# Altium project AD8317.PrjPcb
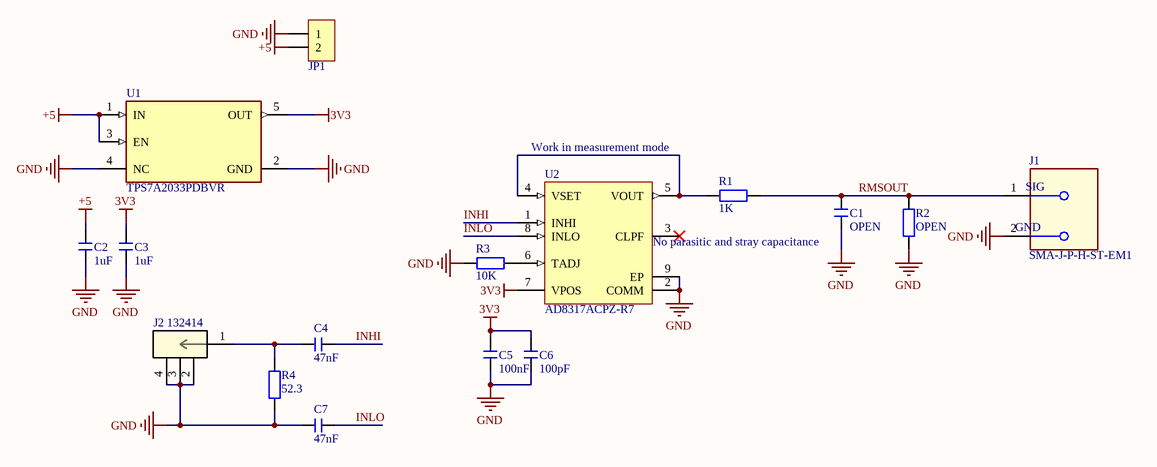
[diagram p0: AD8317.SchDoc]
1 sheet, 16 parts. Net scope: global (net labels, ports and power ports of the same name join across sheets).
Board file: AD8317.PcbDoc

## Sheet AD8317.SchDoc
size A2; SheetNumber: 1; SheetTotal: 1

### Parts
C1  OPEN  [C 0402_L]
C2  1uF  [C 0402_L]
C3  1uF  [C 0402_L]
C4  47nF  [C 0402_L]
C5  100nF  [C 0402_L]
C6  100pF  [C 0402_L]
C7  47nF  [C 0402_L]
J1  SMA-J-P-H-ST-EM1  [FP-SMA-J-P-H-ST-EM1-MFG]
J2  132414  [CONN_132414_AMP]
JP1  HDR-1X2  [KF2510-LI-2P]  (value not drawn)
R1  1K  [R 0402_L]
R2  OPEN  [R 0402_L]
R3  10K  [R 0402_L]
R4  52.3  [R 0402_L]
U1  TPS7A2033PDBVR  [FP-DBV0005A-IPC_C]
U2  AD8317ACPZ-R7  [ADI-CP-8-1_L]

### Nets
3V3: C3.2 C5.2 C6.2 U1.5(OUT) U2.7(VPOS)
+5: C2.1 JP1.2 U1.1(IN) U1.3(EN)
GND: C1.1 C2.2 C3.1 C5.1 C6.1 C7.1 J1.2(MNT_1) J2.2 J2.3 J2.4 JP1.1 R2.1 R3.2 R4.1 U1.2(GND) U1.4(NC) U2.2(COMM) U2.9(EP)
INHI: C4.2 U2.1(INHI)
INLO: C7.2 U2.8(INLO)
RMSOUT: C1.2 J1.1 R1.1 R2.2
NetC4_1: C4.1 J2.1 R4.2
NetR1_2: R1.2 U2.4(VSET) U2.5(VOUT)
NetR3_1: R3.1 U2.6(TADJ)

Not connected (* = marked no-connect by the designer): U2 3(CLPF)*

### Notes on the sheet
- Work in measurement mode
- (near U2) No parasitic and stray capacitance
- (in symbol CMP-02754-000006-1) SIG; GND

### Library data of the parts
C1-C7 = C: 贴片电容; 淘宝ID: 小糖豆的小窝窝; BOM名称: 贴片电容; 下单链接: https://item.taobao.com/item.htm?ft=t&id=613637044352
J1 = CMP-02754-000006-1: CONN SMA JACK STR 50OHM EDGE MNT; Center Contact Plating: Gold; Voltage Rating: 335V; Impedance: 50R; Max Frequency: 6GHz; Body Material: Brass; Dielectric Material: PTFE; Connector Type: SMA; Series: SMA; Fastening Type: Threaded; Depth: 13.33mm; Max Operating Temperature: 125°C; Termination: Solder; Length: 6.35mm; Radiation Hardening: No; RoHS Compliant: Yes; Insulation Material: Polytetrafluoroethylene; Min Operating Temperature: -65°C; Packaging: Tray; Housing Color: Gold; Body Plating: Gold; Mount: Edge; Contact Material: Copper; Orientation: Straight; Package Quantity: 1; Contact Plating: Gold; Case/Package: SMA
J2 = 132414: No Description Available; Mfr_Name: Amphenol ICC; Copyright: Copyright (C) 2022 Ultra Librarian. All rights reserved.; Manufacturer_Part_Number: 132414; RefDes: RefDes; Type: DEV
JP1 = Header 2: 2P接插件; 淘宝ID: 小糖豆的小窝窝; BOM名称: 2P接插件; 下单链接: https://item.taobao.com/item.htm?ft=t&id=613637044352
R1-R4 = R: 贴片电阻; 淘宝ID: 小糖豆的小窝窝; BOM名称: 贴片电阻; 下单链接: https://item.taobao.com/item.htm?ft=t&id=613637044352
U1 = TPS7A2050: 300-mA, ultra-low-noise, low-IQ, low-dropout (LDO) linear regulator with high PSRR 5-SOT-23 -40 to 125; RoHS Compliant: Yes
U2 = CMP-0284-00065-1: 1 MHz to 10 GHz, 55 dB Log Detector/Controller, 6ns Response Time, CP-8-1, Pb-Free, 3000 Reel; Product Description: Available in Die; Voltage Supply (V): 3 to 5.5; Temp Stability (dB): 500mdB; Dynamic Range (dB): 55dB; Supply Current: 22mA; RF Frequency (MHz): 1 to 10000; ComponentLink1Description: Manufacturer URL; PackageVersion: 031207-A; ComponentLink3Description: Package Specification; ComponentLink3URL: http://www.analog.com/static/imported-files/packages/PKG_PDF/LFCSP(CP)/CP-8/CP_8_1.pdf; ComponentLink1URL: www.analog.com; ComponentLink2URL: http://www.analog.com/static/imported-files/data_sheets/AD8317.pdf; PackageReference: CP-8-1; ComponentLink2Description: Datasheet; DatasheetVersion: Rev. B; Response Time (ns typ): 6ns; PackageDescription: 8-Lead Lead Frame Chip Scale Package [LFCSP_VD]